# EAGLE design right_revision3_0 (EAGLE 7.2.0)
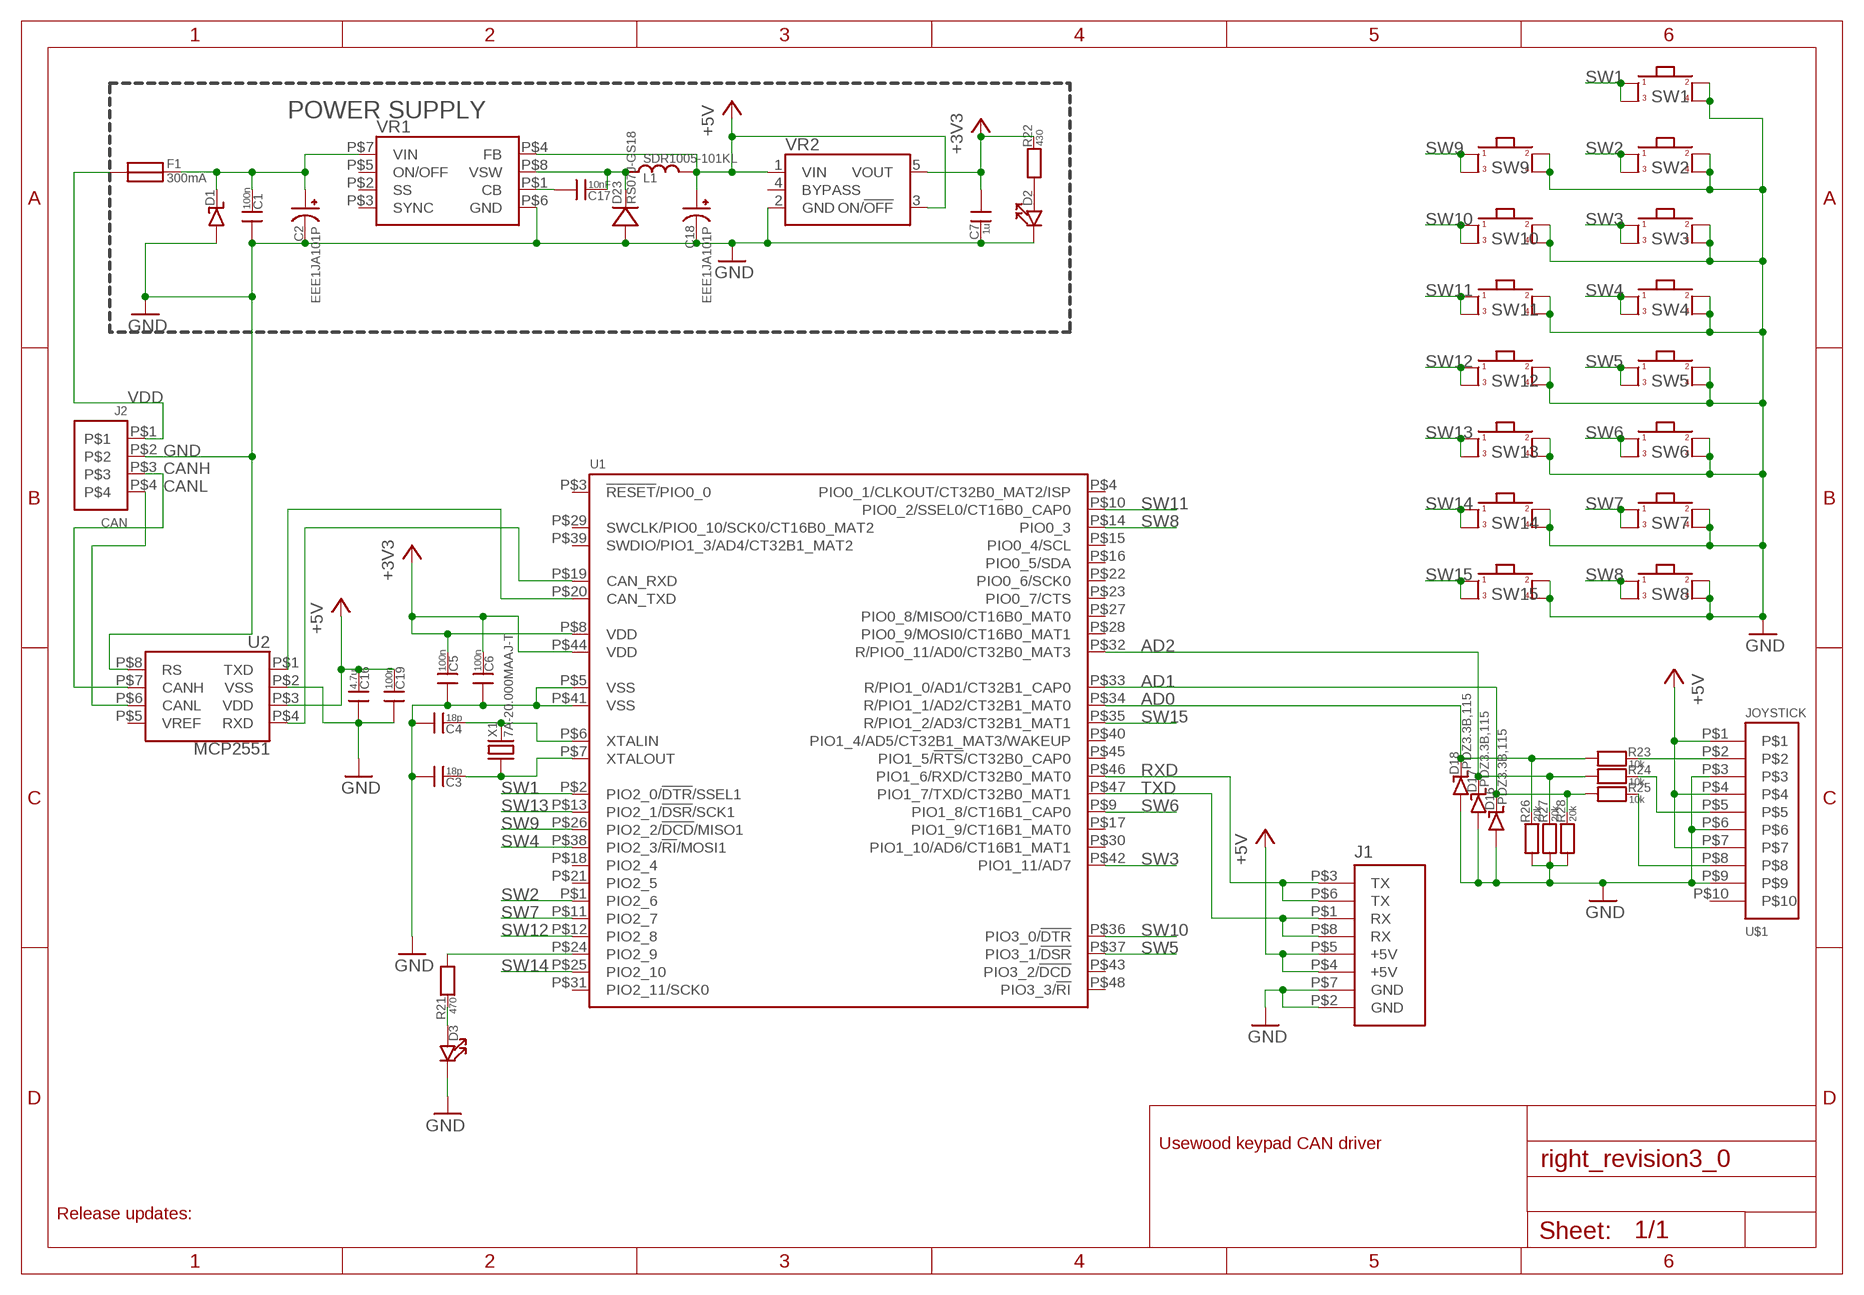
[diagram p0: schematic, sheet 1]

## Parts
C1  100n  CAP_0603  [0603_SILKSCREEN]
C2  EEE1JA101P  CAP_POLSMD_10X10X10MM  [CAP_POL_SMD_10X10X10MM]
C3  18p  CAP_0603  [0603_SILKSCREEN]
C4  18p  CAP_0603  [0603_SILKSCREEN]
C5  100n  CAP_0603  [0603_SILKSCREEN]
C6  100n  CAP_0603  [0603_SILKSCREEN]
C7  1u  CAP_0603  [0603_SILKSCREEN]
C16  4.7u  CAP_0603  [0603_SILKSCREEN]
C17  10nF  CAP_0603  [0603_SILKSCREEN]
C18  EEE1JA101P  CAP_POLSMD_10X10X10MM  [CAP_POL_SMD_10X10X10MM]
C19  100n  CAP_0603  [0603_SILKSCREEN]
D1  DIODE_TVS_SMBJ33A-TRDO-214AA  [DO-214AA]
D2  LED_0603  [0603_SILKSCREEN]
D3  LED_0603  [0603_SILKSCREEN]
D16  PDZ3.3B,115  DIODE_ZENERSDO123  [SOD123]
D17  PDZ3.3B,115  DIODE_ZENERSDO123  [SOD123]
D18  PDZ3.3B,115  DIODE_ZENERSDO123  [SOD123]
D23  RS07J-GS18  DIODEDO219AB  [DO219AB]
F1  300mA  FUSE_MC36204_100MA  [FUSE_100MA]
J1  HEADER_USART_2_SMD  [HEADER_4_2_SMD]
J2  CAN  MOLEX_MICRO-FIT_4WAY_SMD  [MOLEX_MICRO_FIT_4WAY_SMD]
L1  SDR1005-101KL  INDUCTORBOURNS_10X13X5MM  [INDUCTOR_BOURNS_10X13X5MM]
R21  470  RES_0603  [0603_SILKSCREEN]
R22  430  RES_0603  [0603_SILKSCREEN]
R23  10k  RES_0603  [0603_SILKSCREEN]
R24  10k  RES_0603  [0603_SILKSCREEN]
R25  10k  RES_0603  [0603_SILKSCREEN]
R26  20k  RES_0603  [0603_SILKSCREEN]
R27  20k  RES_0603  [0603_SILKSCREEN]
R28  20k  RES_0603  [0603_SILKSCREEN]
SW1  SWITCH_EVQP6L  [SWITCH_EVQ9P6B40]
SW2  SWITCH_EVQP6L  [SWITCH_EVQ9P6B40]
SW3  SWITCH_EVQP6L  [SWITCH_EVQ9P6B40]
SW4  SWITCH_EVQP6L  [SWITCH_EVQ9P6B40]
SW5  SWITCH_EVQP6L  [SWITCH_EVQ9P6B40]
SW6  SWITCH_EVQP6L  [SWITCH_EVQ9P6B40]
SW7  SWITCH_EVQP6L  [SWITCH_EVQ9P6B40]
SW8  SWITCH_EVQP6L  [SWITCH_EVQ9P6B40]
SW9  SWITCH_EVQP6L  [SWITCH_EVQ9P6B40]
SW10  SWITCH_EVQP6L  [SWITCH_EVQ9P6B40]
SW11  SWITCH_EVQP6L  [SWITCH_EVQ9P6B40]
SW12  SWITCH_EVQP6L  [SWITCH_EVQ9P6B40]
SW13  SWITCH_EVQP6L  [SWITCH_EVQ9P6B40]
SW14  SWITCH_EVQP6L  [SWITCH_EVQ9P6B40]
SW15  SWITCH_EVQP6L  [SWITCH_EVQ9P6B40]
U1  LPC11C14_QFP48  [QFP48]
U2  MCP2551  MCP2551_SOIC8  [SOIC8]
U$1  JOYSTICK  MOLEX_MICRO-FIT_10WAY_SMD  [MOLEX_MICRO_FIT_10WAY_SMD]
VR1  LM2671SOIC8  [SOIC8]
VR2  REG_LP2985_SOP5  [SOP5]
X1  7A-20.000MAAJ-T  XTAL_7A-12.000MAAJ-T  [XTAL_SMD_5X3.2]

## Nets
+3V3: C5.1 C6.1 C7.0 R22.1 U1.P$8(VDD) U1.P$44(VDD) VR2.5(VOUT)
+5V: C16.1 C18.+ C19.1 J1.P$4(+5V) J1.P$5(+5V) L1.P$2 U2.P$3(VDD) U$1.P$1 U$1.P$4 U$1.P$7 VR1.P$4(FB) VR2.1(VIN) VR2.3(ON/!OFF)
AD0: D18.P$2(N) R23.0 R26.1 U1.P$34(R/PIO1_1/AD2/CT32B1_MAT0)
AD1: D16.P$2(N) R25.0 R28.1 U1.P$33(R/PIO1_0/AD1/CT32B1_CAP0)
AD2: D17.P$2(N) R24.0 R27.1 U1.P$32(R/PIO0_11/AD0/CT32B0_MAT3)
CANH: J2.P$3 U2.P$7(CANH)
CANL: J2.P$4 U2.P$6(CANL)
GND: C1.0 C2.- C3.0 C4.0 C5.0 C6.0 C7.1 C16.0 C18.- C19.0 D1.P$1(P) D2.1 D3.1 D16.P$1(P) D17.P$1(P) D18.P$1(P) D23.P$1(P) J1.P$2(GND) J1.P$7(GND) J2.P$2 R26.0 R27.0 R28.0 SW1.B SW1.B' SW2.B SW2.B' SW3.B SW3.B' SW4.B SW4.B' SW5.B SW5.B' SW6.B SW6.B' SW7.B SW7.B' SW8.B SW8.B' SW9.B SW9.B' SW10.B SW10.B' SW11.B SW11.B' SW12.B SW12.B' SW13.B SW13.B' SW14.B SW14.B' SW15.B SW15.B' U1.P$5(VSS) U1.P$41(VSS) U2.P$2(VSS) U2.P$8(RS) U$1.P$3 U$1.P$6 U$1.P$9 VR1.P$6(GND) VR2.2(GND)
LED3: D3.0 R21.1
N$1: R21.0 U1.P$24(PIO2_9)
N$3: D2.0 R22.0
N$4: C1.1 C2.+ D1.P$2(N) F1.P$2 VR1.P$7(VIN)
N$6: U1.P$20(CAN_TXD) U2.P$1(TXD)
N$11: C17.1 D23.P$2(N) L1.P$1 VR1.P$8(VSW)
N$20: U1.P$19(CAN_RXD) U2.P$4(RXD)
N$32: C17.0 VR1.P$1(CB)
RXD: J1.P$3(TX) J1.P$6(TX) U1.P$46(PIO1_6/RXD/CT32B0_MAT0)
SW1: SW1.A SW1.A' U1.P$2(PIO2_0/!DTR!/SSEL1)
SW2: SW2.A SW2.A' U1.P$1(PIO2_6)
SW3: SW3.A SW3.A' U1.P$42(PIO1_11/AD7)
SW4: SW4.A SW4.A' U1.P$38(PIO2_3/!RI!/MOSI1)
SW5: SW5.A SW5.A' U1.P$37(PIO3_1/!DSR)
SW6: SW6.A SW6.A' U1.P$9(PIO1_8/CT16B1_CAP0)
SW7: SW7.A SW7.A' U1.P$11(PIO2_7)
SW8: SW8.A SW8.A' U1.P$14(PIO0_3)
SW9: SW9.A SW9.A' U1.P$26(PIO2_2/!DCD!/MISO1)
SW10: SW10.A SW10.A' U1.P$36(PIO3_0/!DTR)
SW11: SW11.A SW11.A' U1.P$10(PIO0_2/SSEL0/CT16B0_CAP0)
SW12: SW12.A SW12.A' U1.P$12(PIO2_8)
SW13: SW13.A SW13.A' U1.P$13(PIO2_1/!DSR!/SCK1)
SW14: SW14.A SW14.A' U1.P$25(PIO2_10)
SW15: SW15.A SW15.A' U1.P$35(R/PIO1_2/AD3/CT32B1_MAT1)
TXD: J1.P$1(RX) J1.P$8(RX) U1.P$47(PIO1_7/TXD/CT32B0_MAT1)
VDD: F1.P$1 J2.P$1
XJOY: R23.1 U$1.P$2
XTALIN: C4.1 U1.P$6(XTALIN) X1.P$2
XTALOUT: C3.1 U1.P$7(XTALOUT) X1.P$1
YJOY: R24.1 U$1.P$5
ZJOY: R25.1 U$1.P$8
Unconnected: U1.P$3(!RESET!/PIO0_0) U1.P$4(PIO0_1/CLKOUT/CT32B0_MAT2/ISP) U1.P$15(PIO0_4/SCL) U1.P$16(PIO0_5/SDA) U1.P$17(PIO1_9/CT16B1_MAT0) U1.P$18(PIO2_4) U1.P$21(PIO2_5) U1.P$22(PIO0_6/SCK0) U1.P$23(PIO0_7/CTS) U1.P$27(PIO0_8/MISO0/CT16B0_MAT0) U1.P$28(PIO0_9/MOSI0/CT16B0_MAT1) U1.P$29(SWCLK/PIO0_10/SCK0/CT16B0_MAT2) U1.P$30(PIO1_10/AD6/CT16B1_MAT1) U1.P$31(PIO2_11/SCK0) U1.P$39(SWDIO/PIO1_3/AD4/CT32B1_MAT2) U1.P$40(PIO1_4/AD5/CT32B1_MAT3/WAKEUP) U1.P$43(PIO3_2/!DCD) U1.P$45(PIO1_5/!RTS!/CT32B0_CAP0) U1.P$48(PIO3_3/!RI) U2.P$5(VREF) U$1.P$10 VR1.P$2(SS) VR1.P$3(SYNC) VR1.P$5(ON/OFF) VR2.4(BYPASS)

## Notes on the sheet
- POWER SUPPLY
- Usewood keypad CAN driver
- Release updates:

## Library data of the parts
C1 C3-C7 C16 C17 C19 = usevolt:CAP; SMD_SIZE: 0603 (1608 metric)
C2 C18 = usevolt:CAP_POL
D1 = usevolt:DIODE_TVS_SMBJ33A-TR: http://www.farnell.com/datasheets/1761316.pdf The Transil SMBJ series from STMicroelectronics are transient voltage suppressing diodes. These diodes are used to protect sensitive equipment against electrostatic discharges and electrical over stress. Transil SMBJ series are generally used against surges below 600W (10/1000 µs). Planar technology makes these devices suitable for high end equipment and SMPS where low leakage current and high junction temperature are required. These devices are packaged in SMB footprint in accordance with IPC 7531 standard. High reliability and stability Peak pulse power of 600W at 10/1000µs and 4KW at 8/20µs Standoff voltage range from 5V to 188V Available in unidirectional and bidirectional types Operating temperature range -55°C to 150°C High power capability of 515W Compliant IEC 61000-4-2 level 4, IEC 61000-4-5, UL 94, EIA STD RS-481 and IEC 60286-3 standards Meets MIL STD 883G, MIL-STD-750 standards; FARNELL_ID: 9886257; MANUFACTURER_ID: SMBJ33A-TR
D2 D3 = usevolt:LED; SMD_SIZE: 0603 (1608 metric)
D16-D18 = usevolt:DIODE_ZENER
D23 = usevolt:DIODE
F1 = usevolt:FUSE_MC36204_100MA: Carrying Current Max: 10A Holding Current: 100mA Initial Resistance Max: 15ohm Operating Temperature Max: 85°C Operating Voltage: 60VDC PTC Fuse Case Style: SMD Product Range: MC36 Series SVHC: No SVHC (15-Jun-2015) Tripping Current: 300mA; FARNELL_ID: 1861161; MANUFACTURER_ID: MC36204
J1 = usevolt:HEADER_USART_2
J2 = usevolt:MOLEX_MICRO-FIT_4WAY: http://www.farnell.com/datasheets/2016912.pdf MOLEX 43045-0418 Wire-To-Board Connector, Vertical, Micro-Fit 3.0 43045 Series, Surface Mount, Header, 4, 3 mm ★★★★★ ★★★★★ Lisää suosikkeihin Huomasitko virheen? Tulosta sivu MOLEX 43045-0418 Suurenna napsauttamalla Kuva on vain kuvaavaa tarkoitusta varten. Lue tuotekuvaus tarkempia tietoja varten. MOLEX Valmistaja MOLEX Tilauskoodi: 9961429 Valmistajan osanumero 43045-0418 Pakkaus:: Yksittäispakkaus Technical Data Sheet (30.17KB) EN Inne rodzaje opakowania Kela 200/kela 2426308 Tarkista saatavuus ja hinta Tuotteen yleiskatsaus Fully polarized housings Positive latching Locking tang on terminal Back to top Tuotetiedot, asiakirjat ja muuta Product Range Micro-Fit 3.0 43045 Series No. of Contacts 4 Pitch Spacing 3mm Contact Termination Type Surface Mount Gender Header
L1 = usevolt:INDUCTOR
R21-R28 = usevolt:RES; SMD_SIZE: 0603 (1608 metric)
SW1-SW15 = usevolt:SWITCH_EVQP6L: http://www.farnell.com/datasheets/1679727.pdf PANASONIC ELECTRONIC COMPONENTS EVQ9P6B40 SWITCH, 4X4MM, 2.4N Lisää suosikkeihin Huomasitko virheen? Tulosta sivu PANASONIC ELECTRONIC COMPONENTS EVQ9P6B40 Suurenna napsauttamalla Kuva on vain kuvaavaa tarkoitusta varten. Lue tuotekuvaus tarkempia tietoja varten. PANASONIC ELECTRONIC COMPONENTS Valmistaja PANASONIC ELECTRONIC COMPONENTS Tilauskoodi: 2079573 Valmistajan osanumero EVQ9P6B40 Technical Data Sheet (124.82KB) EN Tuotetiedot, asiakirjat ja muuta Contact Current Max: 20mA Contact Voltage DC Nom: 15V Illumination: Non Illuminated Operating Force: 2.4N Product Range: - SVHC: No SVHC (15-Jun-2015) Switch Terminals: Solder; FARNELL_ID: 2079541; MANUFACTURER_ID: EVQ-P6LB55; MOUSER_ID: 667-EVQ-P6LB55
U1 = usevolt:LPC11C14: http://www.farnell.com/datasheets/1708214.pdf NXP LPC11C14FBD48/301 32 Bit Microcontroller, Low Power, ARM Cortex-M0, 50 MHz, 32 KB, 8 KB, 48, LQFP Lisää suosikkeihin Huomasitko virheen? Tulosta sivu NXP LPC11C14FBD48/301 Suurenna napsauttamalla Kuva on vain kuvaavaa tarkoitusta varten. Lue tuotekuvaus tarkempia tietoja varten. NXP Valmistaja NXP Tilauskoodi: 1812185 Valmistajan osanumero LPC11C14FBD48/301 Technical Data Sheet (322.12KB) EN Tuotteen yleiskatsaus The LPC11C14FBD48/301 is a 32kB flash 8kB SRAM Cortex-M0 Microcontroller Unit designed for 8/16-bit microcontroller applications, offering performance, low power, simple instruction set and memory addressing together with reduced code size compared to existing 8/16-bit architectures. The peripheral complement of the microcontroller with 32kB of flash memory, 8kB of data memory, one fast-mode Plus I²C-bus interface and one RS-485/EIA-485 UART, two SPI interfaces with SSP features, four general purpose counter/timers, a 10-bit ADC and 40 general purpose I/O pins. ARM Cortex-M0 built-in nested vectored interrupt controller Serial wire debug System tick timer High current output driver on one pin Programmable watchdog timer UART with fractional baud rate generation Integrated PMU to minimize power consumption Sovellukset Metering; Industrial; Sensing & Instrumentation Back to top Tuotetiedot, asiakirjat ja muuta Architecture: ARM Cortex-M0 CPU Speed: 50MHz Embedded Interface Type: CAN, I2C, SPI, UART MCU Case Style: LQFP MSL: - No. of I/O's: 40 No. of Pins: 48 Packaging: Each Program Memory Size: 32KB RAM Memory Size: 8KB SVHC: No SVHC (15-Jun-2015) Supply Voltage Max: 3.6V Supply Voltage Min: 1.8V; FARNELL_ID: 1812185; MANUFACTURER_ID: LPC11C14FBD48/301; MOUSER_ID: 771-LPC11C14FD48301
U2 = usevolt:MCP2551: Microchip High-Speed CAN Transceiver Supports 1 Mb/s operation • Implements ISO-11898 standard physical layer requirements • Suitable for 12V and 24V systems • Externally-controlled slope for reduced RFI emissions • Detection of ground fault (permanent dominant) on TXD input • Power-on reset and voltage brown-out protection • An unpowered node or brown-out event will not disturb the CAN bus • Low current standby operation • Protection against damage due to short-circuit conditions (positive or negative battery voltage) • Protection against high-voltage transients • Automatic thermal shutdown protection • Up to 112 nodes can be connected • High noise immunity due to differential bus implementation • Temperature ranges: - Industrial (I): -40°C to +85°C - Extended (E): -40°C to +125°C http://www.digikey.com/product-detail/en/MCP2551T-E%2FSN/MCP2551T-E%2FSNCT-ND/4307904 http://ww1.microchip.com/downloads/en/DeviceDoc/21667f.pdf http://www.farnell.com/datasheets/657417.pdf http://fi.farnell.com/microchip/mcp2551-i-sn/ic-can-transceiver-hi-speed-smd/dp/9758569
U$1 = usevolt:MOLEX_MICRO-FIT_10WAY: http://www.farnell.com/datasheets/1629759.pdf MOLEX 43045-1006 Wire-To-Board Connector, Right Angle, Micro-Fit 3.0 43045 Series, Surface Mount, Header, 10, 3 mm ★★★★★ ★★★★★ Lisää suosikkeihin Huomasitko virheen? Tulosta sivu MOLEX 43045-1006 Suurenna napsauttamalla Kuva on vain kuvaavaa tarkoitusta varten. Lue tuotekuvaus tarkempia tietoja varten. MOLEX Valmistaja MOLEX Tilauskoodi: 1513882 Valmistajan osanumero 43045-1006 Technical Data Sheet (38.25KB) EN Tuotteen yleiskatsaus Fully polarized housings Positive latching Locking tang on terminal Back to top Tuotetiedot, asiakirjat ja muuta Product Range Micro-Fit 3.0 43045 Series No. of Contacts 10 Pitch Spacing 3mm Contact Termination Type Surface Mount Gender Header No. of Rows 2
VR1 = usevolt:LM2671: TEXAS INSTRUMENTS LM2671MX-5.0/NOPB IC, STEP-DOWN REGULATOR, SOIC-8 http://www.farnell.com/datasheets/1874686.pdf
VR2 = usevolt:REG_LP2985: http://www.farnell.com/datasheets/1965480.pdf TEXAS INSTRUMENTS LP2985-33DBVTE4 Fixed LDO Voltage Regulator, 2.2V to 16V, 280mV Dropout, 3.3Vout, 150mAout, SOT-23-5 Lisää suosikkeihin Huomasitko virheen? Tulosta sivu TEXAS INSTRUMENTS LP2985-33DBVTE4 Suurenna napsauttamalla Kuva on vain kuvaavaa tarkoitusta varten. Lue tuotekuvaus tarkempia tietoja varten. TEXAS INSTRUMENTS Valmistaja TEXAS INSTRUMENTS Tilauskoodi: 1053672 Valmistajan osanumero LP2985-33DBVTE4 Technical Data Sheet (1.24MB) EN Tuotteen yleiskatsaus The LP2985-33DBVTE4 is a 150mA 3.3V low quiescent current low noise fixed-output low-dropout regulator available in voltage of 3.3V, the family has an output tolerance of 1.5% for the non-A version and is capable of delivering 150mA continuous load current. Standard regulator features, such as over-current and over-temperature protection are included. 0.01µA Typical Shutdown current 30µVRMS Low noise with 10nF bypass capacitor Stable with low-ESR capacitors, including ceramic Over-current and thermal protection High peak-current capability ESD protection exceeds JESD 22 Green product and no Sb/Br Sovellukset Power Management; Consumer Electronics; Portable Devices This device has limited built-in ESD protection, leads should be shorted together or the device placed in conductive foam during storage or handling to prevent electrostatic damage to the MOS gates. Back to top Tuotetiedot, asiakirjat ja muuta Dropout Voltage Vdo: 280mV Input Voltage Max: 16V Input Voltage Min: 2.2V LDO Regulator Case Style: SOT-23 MSL: MSL 1 - Unlimited No. of Pins: 5 Operating Temperature Max: 125°C Operating Temperature Min: -40°C Output Current: 150mA Output Voltage Nom.: 3.3V Packaging: Cut Tape; FARNELL_ID: 1053672; INPUT_VOLTAGE_MAX: 16 V; MANUFACTURER_ID: LP2985-33DBVTE4; OUTPUT_CURRENT: 150 mA; OUTPU_VOLTAGE: 3.3 V
X1 = usevolt:XTAL_7A-12.000MAAJ-T: http://www.farnell.com/datasheets/1041607.pdf TXC 7A-12.000MAAJ-T XTAL, 12.000MHZ, 18PF, SMD, 5.0X3.2 ★★★★★ ★★★★★ Lisää suosikkeihin Huomasitko virheen? Tulosta sivu TXC 7A-12.000MAAJ-T Suurenna napsauttamalla Kuva on vain kuvaavaa tarkoitusta varten. Lue tuotekuvaus tarkempia tietoja varten. TXC Valmistaja TXC Tilauskoodi: 1841940RL Valmistajan osanumero 7A-12.000MAAJ-T Technical Data Sheet (503.86KB) EN Uudelleenkelauspalvelut Tuotteen yleiskatsaus The 7A-12.000MAAJ-T is a 5 x 3.2mm SMD Glass Sealed Quartz Crystal. It is designed for automatic mounting and reflow soldering. 2 Pads SMD Glass Sealed Crystal Unit High Reliable Environmental Performance Tight Tolerance and Stability Reasonable Cost and Good Delivery Performance Contains Pb in Sealing Glass Exempted by RoHS Directive Ageing ±3ppm Per Year Max Sovellukset Portable Devices; Computers & Computer Peripherals Back to top Tuotetiedot, asiakirjat ja muuta Product Range 7A Series Frequency Nom 12MHz Frequency Stability + / - 30ppm Frequency Tolerance + / - 30ppm Crystal Case SMD, 5mm x 3.2mm Load Capacitance 18pF Operating Temperature Min -40°C Operating Temperature Max 85°C SVHC; FARNELL_ID: 1841940RL; MANUFACTURER_ID: 7A-12.000MAAJ-T

## Board
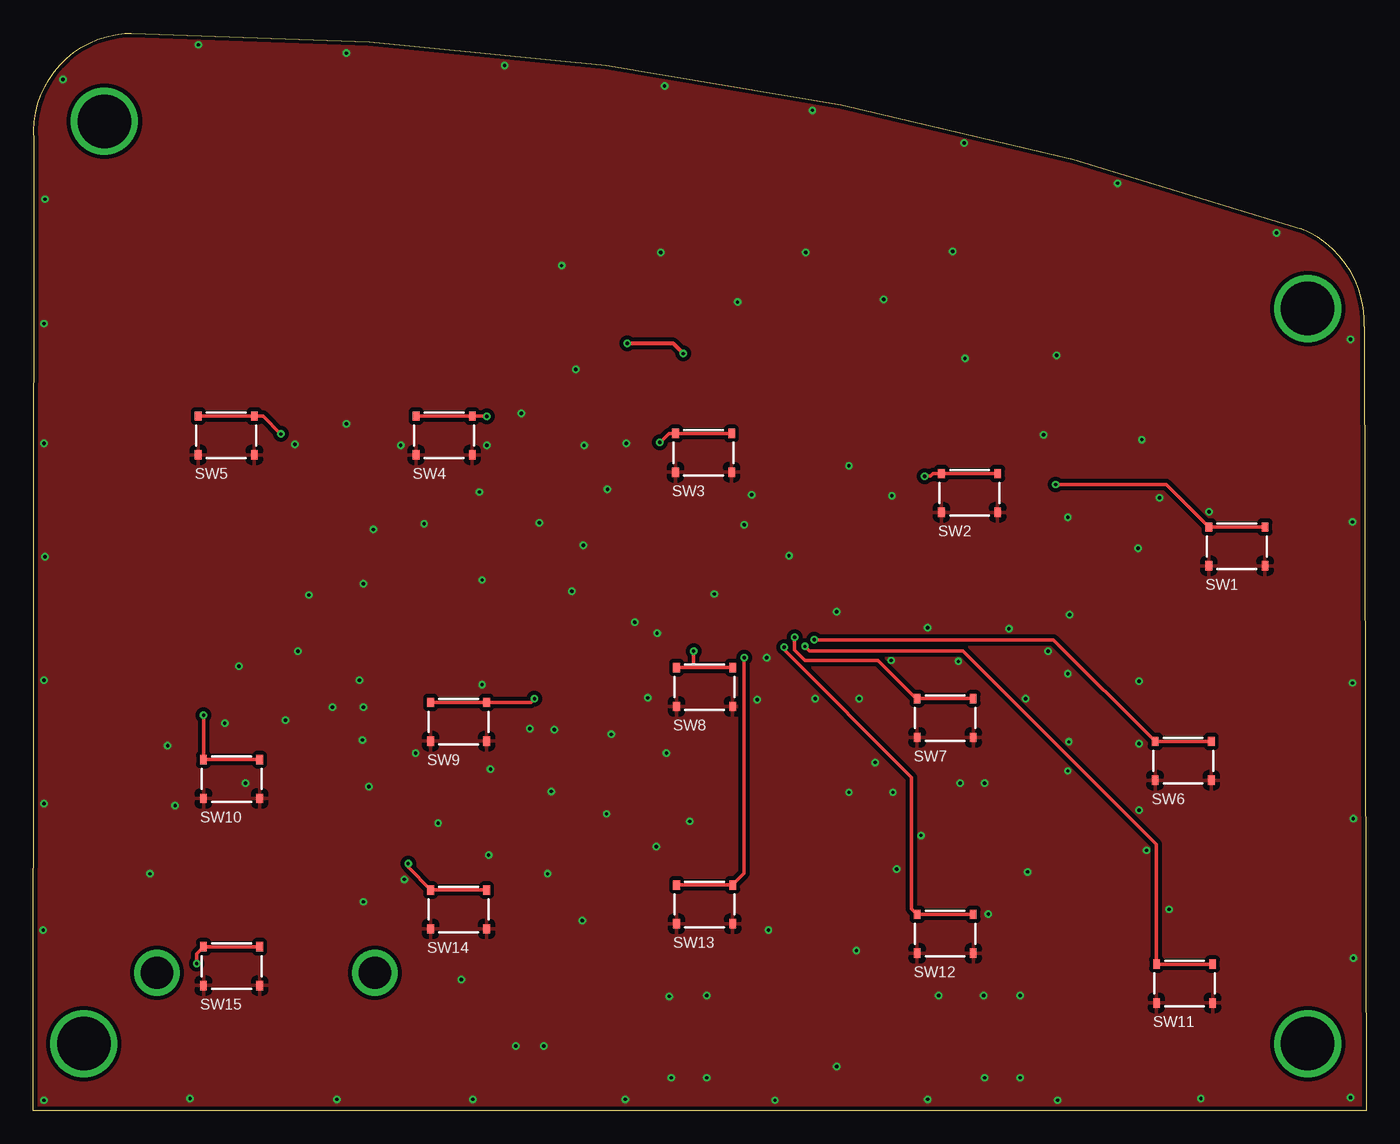
[diagram p1: board, top side]
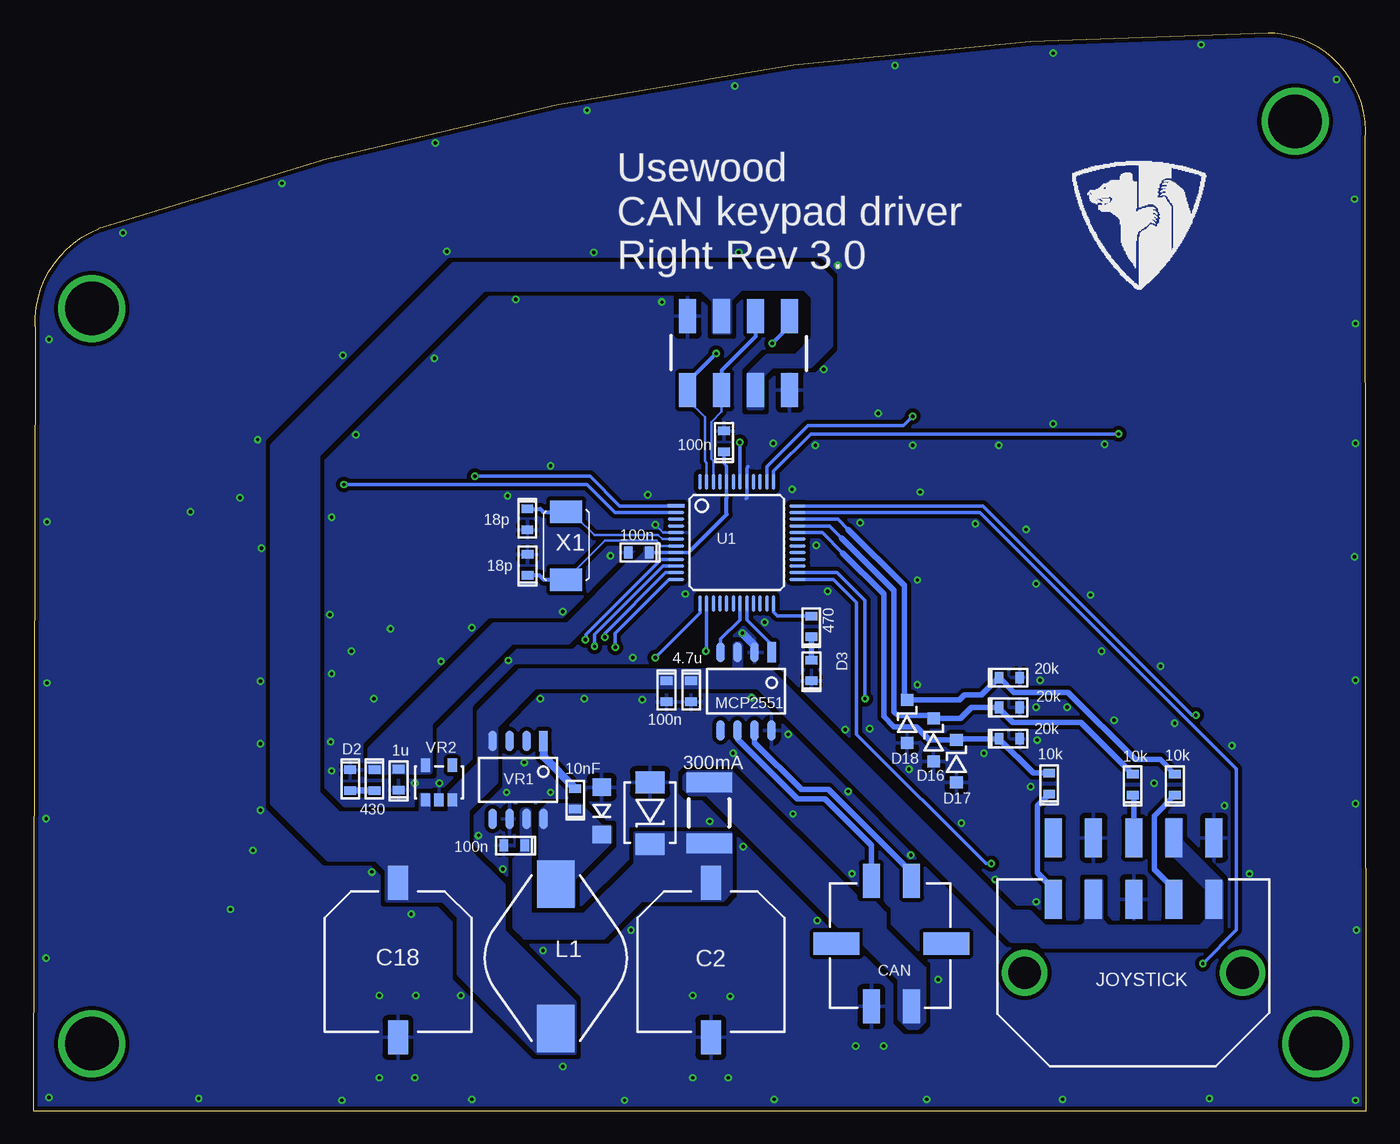
[diagram p2: board, bottom side, seen from below]

Size 99.68 x 80.58 mm. Coordinates in mm from the lower left corner, seen from the top.
Outline: 0,0 0.05,72.6 arc-90 6.81,80.58 7.31,80.58 arc-19 94.8,65.97 arc-71 99.54,58.64 99.68,0 0,0
Copper layers (1*16): Top 0.035mm / dielectric 1.5mm / Bottom 0.035mm
Design rules "SeeedStudio_2layer_DRU_no_angle_20140221 *": minimum track width 6mil, minimum drill 8mil, track to track 6mil, track to pad 6mil, pad to pad 6mil, via to via 6mil, smd to smd 0mil, copper to edge 10mil, drill to drill 10mil, minimum pad ring 10mil, minimum via ring 6mil, stop-mask expansion 2mil, vias tented up to drill 100mil, thermal gap 16mil

### Footprints (pad centres in the part's own frame; a part is rotated, then mirrored left to right if it is on the bottom)
0603_SILKSCREEN = smd 0.635 x 0.889: 0 -0.978,0; 1 0.584,0
CAP_POL_SMD_10X10X10MM = smd 1.5 x 2.54: + 0,-0.635; - 0,10.935
DO-214AA = smd 1.62 x 2.18: P$1 0,0; P$2 4.6,0
SOD123 = smd 0.9 x 0.95: P$1 0,0; P$2 3.2,0
DO219AB = smd 1.3 x 1.4: P$1 0,0; P$2 3.535,0
FUSE_100MA = smd 1.5 x 3.41: P$1 0,0; P$2 4.572,0
HEADER_4_2_SMD = smd 2.54 x 1.27: P$1 -0.457,0; P$2 5.08,0; P$3 -0.457,-2.54; P$4 5.08,-2.54; P$5 -0.457,-5.08; P$6 5.08,-5.08; P$7 -0.457,-7.62; P$8 5.08,-7.62
MOLEX_MICRO_FIT_4WAY_SMD = smd 1.27 x 2.54: P$1 1.55,-4.65; P$2 -1.45,-4.65; P$3 1.55,4.75; P$4 -1.45,4.75 | smd 3.43 x 1.65: P$5 4.15,0.05; P$6 -4.05,0.05
INDUCTOR_BOURNS_10X13X5MM = smd 3.556 x 2.8: P$1 -1.754,0; P$2 9.054,0
SWITCH_EVQ9P6B40 = smd 0.5 x 0.7: A -2.087,1.453; A' 2.113,1.453; B -2.087,-1.447; B' 2.113,-1.447
QFP48 = smd 1.246 x 0.28: P$1 0.327,0; P$2 0.327,-0.5; P$3 0.327,-1; P$4 0.327,-1.5; P$5 0.327,-2; P$6 0.327,-2.5; P$7 0.327,-3; P$8 0.327,-3.5; P$9 0.327,-4; P$10 0.327,-4.5; P$11 0.327,-5; P$12 0.327,-5.5; P$25 9.423,-5.5; P$26 9.423,-5; P$27 9.423,-4.5; P$28 9.423,-4; P$29 9.423,-3.5; P$30 9.423,-3; P$31 9.423,-2.5; P$32 9.423,-2; P$33 9.423,-1.5; P$34 9.423,-1; P$35 9.423,-0.5; P$36 9.423,0 | smd 0.28 x 1.246: P$13 2.125,-7.298; P$14 2.625,-7.298; P$15 3.125,-7.298; P$16 3.625,-7.298; P$17 4.125,-7.298; P$18 4.625,-7.298; P$19 5.125,-7.298; P$20 5.625,-7.298; P$21 6.125,-7.298; P$22 6.625,-7.298; P$23 7.125,-7.298; P$24 7.625,-7.298; P$37 7.625,1.798; P$38 7.125,1.798; P$39 6.625,1.798; P$40 6.125,1.798; P$41 5.625,1.798; P$42 5.125,1.798; P$43 4.625,1.798; P$44 4.125,1.798; P$45 3.625,1.798; P$46 3.125,1.798; P$47 2.625,1.798; P$48 2.125,1.798
SOIC8 = smd 1.524 x 0.635: P$1 -2.286,2.54; P$2 -2.286,1.27; P$3 -2.286,0; P$4 -2.286,-1.27; P$5 3.556,-1.27; P$6 3.556,0; P$7 3.556,1.27; P$8 3.556,2.54
MOLEX_MICRO_FIT_10WAY_SMD = smd 1.27 x 2.92: P$1 -2.15,5.5; P$2 -5.15,5.5; P$3 -8.15,5.5; P$4 -11.15,5.5; P$5 -14.15,5.5; P$6 -2.15,10.1; P$7 -5.15,10.1; P$8 -8.15,10.1; P$9 -11.15,10.1; P$10 -14.15,10.1 | drill 2.41: P$11 0,0; P$12 -16.3,0
SOP5 = smd 0.7 x 1: 1 -1,0; 2 0,0; 3 1,0; 4 1,2.6; 5 -1,2.6
XTAL_SMD_5X3.2 = smd 1.7 x 2.4: P$1 -2.54,0; P$2 2.54,0

### Placement (x,y rotation side)
C1  63.52,19.83 0 bottom
C2  49.01,16.4 180 bottom
C3  62.73,40.63 270 bottom
C4  62.74,44.42 90 bottom
C5  54.21,41.74 0 bottom
C6  48.03,49.86 270 bottom
C7  72.36,24.56 270 bottom
C16  50.49,31.56 90 bottom
C17  59.16,23.12 270 bottom
C18  72.41,16.4 180 bottom
C19  52.33,31.56 90 bottom
D1  53.56,24.54 270 bottom
D2  75.98,24.91 90 bottom
D3  41.49,32.73 270 bottom
D16  32.35,26.13 90 bottom
D17  30.65,24.54 90 bottom
D18  34.33,27.51 90 bottom
D23  57.17,24.19 270 bottom
F1  49.15,24.56 270 bottom
J1  43.12,58.97 270 bottom
J2  35.55,12.44 0 bottom
L1  60.61,15.2 270 bottom
R21  41.5,36.02 270 bottom
R22  74.18,24.91 90 bottom
R23  14.3,24.19 270 bottom
R24  23.71,24.27 270 bottom
R25  17.45,24.19 270 bottom
R26  26.87,32.38 180 bottom
R27  26.87,27.82 180 bottom
R28  26.87,30.16 180 bottom
SW1  90.01,42.2 0 top
SW2  70.01,46.2 0 top
SW3  50.11,49.2 0 top
SW4  30.71,50.5 0 top
SW5  14.41,50.5 0 top
SW6  85.99,26.16 0 top
SW7  68.19,29.36 0 top
SW8  50.19,31.68 0 top
SW9  31.79,29.08 0 top
SW10  14.81,24.8 0 top
SW11  86.09,9.5 0 top
SW12  68.19,13.22 0 top
SW13  50.19,15.42 0 top
SW14  31.79,15.04 0 top
SW15  14.81,10.8 0 top
U1  51.95,45.24 0 bottom
U2  47.01,32 270 bottom
U$1  9.24,10.3 0 bottom
VR1  64.08,25.36 270 bottom
VR2  69.35,23.24 0 bottom
X1  59.83,42.25 90 bottom

### Tracks (layer width: path | path; a pad name or v marks a point on that pad's centre or on a via)
+3V3
  Bottom 0.25: C5.1 U1.P$8 50.69,41.74 50.5,41.93 | 47.84,45.85 47.83,45.87 U1.P$44 47.83,48.22 48.03,48.42 C6.1
  Bottom 0.3: 50.5,41.93 47.84,44.59 47.84,45.85
  pour Bottom (no thermals): 74.51,25.34 70.1,25.34 70.03,25.41 70.03,28.98 63.94,35.07 59.74,35.07 53.51,41.3 53.51,42 53.86,42 53.86,41.72 54.77,40.81 55.19,40.81 59.67,36.33 65.2,36.33 74.51,27.02
+5V
  pour Bottom (no thermals): 59.25,4.34 59.25,8.05 64.57,13.37 64.57,16.8 67.23,19.46 67.23,22.54 65.13,24.64 65.13,28.77 62.19,31.71 45.46,31.71 26.49,12.74 24.6,12.74 24.18,12.32 12,12.32 10.88,13.44 10.88,17.08 13.89,20.09 13.89,21.7 14.87,21.7 14.87,19.11 14.31,19.11 11.86,16.66 11.86,14.21 12.35,13.72 19.35,13.72 19.84,14.21 19.84,17.15 20.89,17.15 20.89,14 21.17,13.72 24.11,13.72 25.23,14.84 26.56,14.84 44.62,32.9 46.79,32.9 46.79,34.79 46.93,34.93 47.07,34.93 47.21,34.79 47.21,32.9 63.24,32.9 66.32,29.82 66.32,25.9 68.49,23.73 68.49,22.19 70.17,22.19 70.17,23.59 70.66,23.59 70.66,22.19 76.89,22.19 78.43,23.73 78.43,49.07 66.04,61.46 49.66,61.46 48.75,60.55 48.75,58.24 47.63,58.24 47.63,60.69 46.79,61.53 41.96,61.53 41.33,60.9 41.33,57.75 42.66,56.42 44.76,56.42 46.16,55.02 46.16,52.57 45.18,52.57 45.18,55.02 44.48,55.72 41.61,55.72 40.07,57.26 40.07,62.16 41.19,63.28 68.21,63.28 81.79,49.7 81.79,23.03 77.59,18.83 74.02,18.83 73.18,17.99 73.18,15.75 69.05,15.75 67.79,14.49 67.79,10.22 61.91,4.34
AD0
  Bottom 0.25: 38.74,43.47 39.51,44.24 U1.P$34
  Bottom 0.4: R23.0 15.39,26.25 17.25,26.25 22.29,31.29 26.35,31.29 27.44,32.38 R26.1 28.76,31.08 30.06,31.08 30.43,30.71 D18.P$2 34.54,30.92 34.54,39.27 38.74,43.47
AD1
  Bottom 0.25: 39.23,42.84 40.13,43.74 U1.P$33
  Bottom 0.4: R25.0 21.34,29.05 26.42,29.05 27.46,30.09 R28.1 29.51,30.16 30.34,29.33 D16.P$2 32.56,29.54 35.03,29.54 35.31,29.82 35.31,38.92 39.23,42.84
AD2
  Bottom 0.25: 39.16,41.72 40.68,43.24 U1.P$32
  Bottom 0.4: R24.0 24.89,25.24 R27.1 30.57,27.82 D17.P$2 32.67,27.74 33.63,28.7 35.31,28.7 36.08,29.47 36.08,38.64 39.16,41.72
CANH
  Bottom 0.4: J2.P$3 34,17.8 40.21,24.01 42.24,24.01 45.74,27.51 U2.P$7
CANL
  Bottom 0.4: J2.P$4 37,19.82 40.49,23.31 42.52,23.31 47.01,27.8 U2.P$6
GND  (via drill 0.25)
  Bottom 0.2: U1.P$5 52.58,43.24 v53.16,43.82
  Bottom 0.25: 46.37,45.78 46.33,45.83 U1.P$41 46.33,48.06 46.23,48.16
  Bottom 0.6: U2.P$2 45.74,34.79 v46.65,35.7
  other vias: 71.15,24.5 69.33,24.5 62.96,26.04 64.29,23.8 61,23.8 56.52,41.51 38.46,17.71 34.19,25.55 22.36,30.17 24.67,30.17 92.99,65.66 81.09,69.37 69.61,72.38 58.27,74.83 47.21,76.65 98.52,57.68 98.66,44.03 98.66,31.99 98.73,21.84 98.73,11.41 98.52,0.98 87.32,0.91 76.61,0.77 66.88,0.84 55.47,0.77 44.27,0.84 32.86,0.84 22.71,0.84 11.72,0.91 0.8,0.77 0.73,13.51 0.8,22.96 0.8,32.2 0.87,41.44 0.8,49.91 0.8,58.87 0.87,68.18 2.2,77.14 12.35,79.73 23.41,79.1 35.24,78.19 69.19,33.6 66.88,36.12 72.97,36.05 64.15,33.67 46.93,64.19 39.51,63.21 40.56,55.44 52.67,60.48 57.78,64.19 68.77,64.26 63.59,60.69 69.68,56.28 75.56,50.54 77.38,44.38 77.52,37.1 82.7,32.13 82.63,42.07 84.24,45.85 87.95,44.8 82.91,50.19 76.54,56.49 61,48.23 64.22,45.99 53.72,46.06 60.09,37.31 50.92,38.64 44.34,49.91 41.19,49.77 42.94,46.48 41.12,42.28 40.28,38.85 44.97,36.54 54.84,33.88 75.91,34.37 77.38,32.69 73.81,2.45 71.15,2.45 71.08,8.61 67.72,8.61 73.81,8.61 71.43,14.7 74.37,17.85 83.26,19.46 84.94,15.05 82.7,22.47 82.7,27.44 77.38,25.41 77.45,27.58 74.23,30.8 61.77,30.8 58.48,30.8 54.14,30.73 66.39,20.58 64.57,18.06 61.56,11.97 60.09,3.29 54.98,13.51 49.1,21.63 46.58,19.74 41.05,14.21 47.56,8.54 50.36,8.61 50.36,2.45 47.7,2.45 38.18,4.83 36.08,4.83 32.02,9.8 34.05,19.11 38.74,23.87 42.87,22.19 47.35,26.74 43.22,28.14 45.95,30.87 38.95,28.49 37.13,28.56 28.59,26.74 25.09,24.22 30.27,21.49 24.67,15.61 24.6,27.72 24.39,32.2 33.56,31.85 33.56,39.69 37.83,43.96 29.22,43.89 25.44,43.47 24.67,39.41 20.61,38.57 19.77,34.37 15.36,33.25 14.31,28.98 18.86,29.19 15.85,24.5 27.75,17.29 8.71,17.71 10.6,22.82 10.04,27.3 19.56,49.84 23.41,51.38 27.47,49.77 33.35,46.27 33.91,49.77 36.5,52.15
  pour Top (isolate 0.3, rank 6): 0,0 0,72.58 arc-48 2.76,78.82 arc-42 7.03,80.5 arc-20 95.02,65.87 arc-21 96.7,64.89 arc-53 99.57,58.03 99.57,0
  pour Bottom (isolate 0.3, rank 6): 0,0 0,72.58 arc-48 2.76,78.82 arc-42 7.03,80.5 arc-20 95.02,65.87 arc-21 96.7,64.89 arc-53 99.57,58.03 99.57,0
LED3
  Bottom 0.4: R21.1 D3.0
N$1
  Bottom 0.25: U1.P$24 44.33,37.3 44.02,36.99 R21.0
N$3
  Bottom 0.5: D2.0 R22.0
N$4
  pour Bottom (no thermals): 48.12,15.75 47.49,16.38 47.49,20.72 54.7,20.72 54.7,18.41 58.48,14.63 62.54,14.63 62.54,22.4 62.68,22.54 63.03,22.54 63.17,22.4 63.17,19.32 63.73,18.76 63.73,13.72 62.96,12.95 57.01,12.95 54.21,15.75
N$6
  Bottom 0.25: U2.P$1 44.47,34.85 46.33,36.7 U1.P$20
N$7  (via drill 4)
  other vias: 3.76,5
N$8  (via drill 4)
  other vias: 95.31,5
N$9  (via drill 4)
  other vias: 95.31,60
N$10  (via drill 4)
  other vias: 5.31,74
N$11
  pour Bottom (no thermals): 61.84,15.33 59.25,15.33 59.25,17.36 56.52,20.09 56.52,21.21 57.15,21.21 58.76,22.82 61.28,22.82 61.77,22.33 61.77,18.62 61.84,18.62
N$20
  Bottom 0.25: U2.P$4 48.28,35.26 46.83,36.72 U1.P$19
N$32
  Bottom 0.6: VR1.P$1 61.54,26.48 C17.0
RXD
  Bottom 0.2: J1.P$6 48.2,52.28 48.96,51.52 48.96,48.72 48.82,48.58 U1.P$46
  Bottom 0.3: J1.P$3 45.66,57.9 48.2,55.36 J1.P$6
SW1  (via drill 0.25)
  Top 0.25: v76.47,46.83 84.75,46.83 SW1.A SW1.A'
  Bottom 0.25: U1.P$2 56.18,44.74 58.27,46.83 v76.47,46.83
SW2  (via drill 0.25)
  Top 0.25: v66.67,47.46 67.09,47.46 67.28,47.65 SW2.A SW2.A'
  Bottom 0.25: U1.P$1 55.84,45.24 58.06,47.46 v66.67,47.46
SW3  (via drill 0.25)
  Top 0.25: v46.86,49.98 47.53,50.65 SW3.A SW3.A'
  Bottom 0.25: U1.P$42 46.83,49.95 v46.86,49.98
SW4  (via drill 0.25)
  Top 0.25: v33.91,51.94 32.91,51.94 SW4.A' SW4.A
  Bottom 0.25: U1.P$38 44.83,48.16 41.75,51.24 34.61,51.24 v33.91,51.94
SW5  (via drill 0.25)
  Top 0.25: v18.51,50.61 17.17,51.95 SW5.A' SW5.A
  Bottom 0.25: U1.P$37 44.33,47.83 41.54,50.61 v18.51,50.61
SW6  (via drill 0.25)
  Top 0.25: v58.41,35.21 76.31,35.21 SW6.A SW6.A'
  Bottom 0.25: U1.P$9 52.73,41.24 58.34,35.63 58.34,35.28 v58.41,35.21
SW7  (via drill 0.25)
  Top 0.25: v56.94,35.42 56.94,34.44 57.71,33.67 63.18,33.67 63.45,33.39 66.03,30.81 SW7.A SW7.A'
  Bottom 0.25: U1.P$11 52.4,40.24 56.94,35.7 v56.94,35.42
SW8  (via drill 0.25)
  Top 0.25: v49.38,34.37 49.38,33.13 | 49.38,33.13 SW8.A | SW8.A' 49.38,33.13
  Bottom 0.25: U1.P$14 49.33,34.42 v49.38,34.37
SW9  (via drill 0.25)
  Top 0.25: v37.48,30.8 37.21,30.53 SW9.A' SW9.A
  Bottom 0.25: U1.P$26 39.57,40.24 37.48,38.15 v37.48,30.8
SW10  (via drill 0.25)
  Top 0.25: SW10.A' SW10.A v12.72,29.56 v12.73,29.57
  Bottom 0.25: U1.P$36 28.68,45.24 13.01,29.57 v12.73,29.57
SW11  (via drill 0.25)
  Top 0.25: v57.71,34.72 58.06,34.37 69.54,34.37 84,19.91 SW11.A SW11.A'
  Bottom 0.25: U1.P$10 52.6,40.74 57.71,35.63 v57.71,34.72
SW12  (via drill 0.25)
  Top 0.25: v56.17,34.65 56.17,34.44 65.68,24.93 65.68,15.09 SW12.A SW12.A'
  Bottom 0.25: U1.P$12 52.13,39.74 56.17,35.7 v56.17,34.65
SW13  (via drill 0.25)
  Top 0.25: v53.16,33.88 53.16,17.73 SW13.A' SW13.A
  Bottom 0.25: U1.P$13 49.83,37.22 v53.16,33.88
SW14  (via drill 0.25)
  Top 0.25: v28.03,18.48 28.03,18.24 SW14.A SW14.A'
  Bottom 0.25: U1.P$25 39.84,39.74 38.11,38.01 38.11,28.14 28.45,18.48 v28.03,18.48
SW15  (via drill 0.25)
  Top 0.25: v12.21,10.99 12.21,11.74 SW15.A SW15.A'
  Bottom 0.25: U1.P$35 28.88,44.74 9.69,25.55 9.69,13.51 v12.21,10.99
TXD  (via drill 0.25)
  Top 0.3: v44.41,57.4 47.84,57.4 v48.61,56.63
  Bottom 0.2: U1.P$47 49.33,48.45 49.45,48.58 49.45,51.87 50.74,53.16 J1.P$8
  Bottom 0.3: J1.P$1 43.12,58.69 v44.41,57.4 | v48.61,56.63 50.74,54.5 J1.P$8
VDD
  pour Bottom (no thermals): 50.99,24.08 50.99,24.99 50.64,25.34 47.49,25.34 38.25,16.1 38.25,15.82 37.97,15.54 36.78,15.54 36.01,14.77 36.01,13.58 33.07,10.64 33.07,6.65 33.56,6.16 34.19,6.16 34.89,6.86 34.89,9.8 37.48,12.39 37.48,13.79 39.44,13.79 49.31,23.66 50.57,23.66
XJOY
  Bottom 0.4: U$1.P$2 14.39,16.6 15.85,18.06 15.85,22.06 R23.1
XTALIN
  Bottom 0.2: U1.P$6 52.64,42.74 52.95,43.05 57.71,43.05 59.04,44.38 59.42,44.38 X1.P$2
  Bottom 0.3: C4.1 61.76,45 61.55,44.79 X1.P$2
XTALOUT
  Bottom 0.2: U1.P$7 52.7,42.24 53.09,42.63 56.91,42.63 X1.P$1
  Bottom 0.3: C3.1 61.85,40.05 61.51,39.71 X1.P$1
YJOY
  Bottom 0.4: U$1.P$5 23.39,16.57 24.6,17.78 24.6,22.79 R24.1
ZJOY
  Bottom 0.4: U$1.P$8 17.39,23.54 R25.1

### Text on the board
bPlace: Usewood / CAN keypad driver / Right Rev 3.0